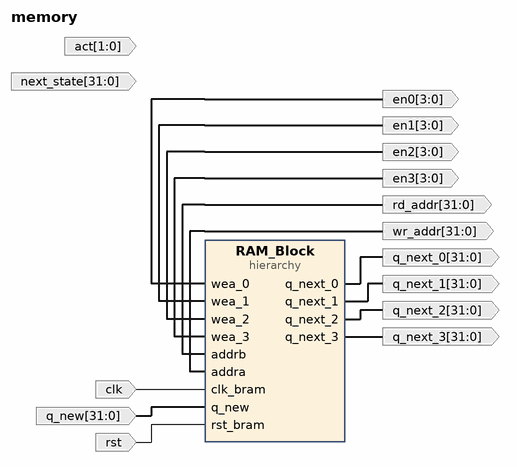
[diagram p0: block diagram of the top level]
# Vivado block design memory, xc7z020clg400-1, Vivado 2021.1
create_bd_design memory

create_bd_port -dir I -type clk clk
set_property -dict {CONFIG.FREQ_HZ 50000000} [get_bd_ports clk]
create_bd_port -dir I -type rst rst
create_bd_port -dir I -from 31 -to 0 q_new
create_bd_port -dir O -from 31 -to 0 q_next_3
create_bd_port -dir O -from 31 -to 0 q_next_0
create_bd_port -dir O -from 31 -to 0 q_next_1
create_bd_port -dir O -from 31 -to 0 q_next_2
create_bd_port -dir O -from 31 -to 0 rd_addr
create_bd_port -dir O -from 31 -to 0 wr_addr
create_bd_port -dir O -from 3 -to 0 en0
create_bd_port -dir O -from 3 -to 0 en1
create_bd_port -dir O -from 3 -to 0 en2
create_bd_port -dir O -from 3 -to 0 en3
create_bd_port -dir I -from 1 -to 0 act
create_bd_port -dir I -from 31 -to 0 next_state

create_bd_cell -type hier RAM_Block

# ---- hierarchy /RAM_Block ----
current_bd_instance /RAM_Block
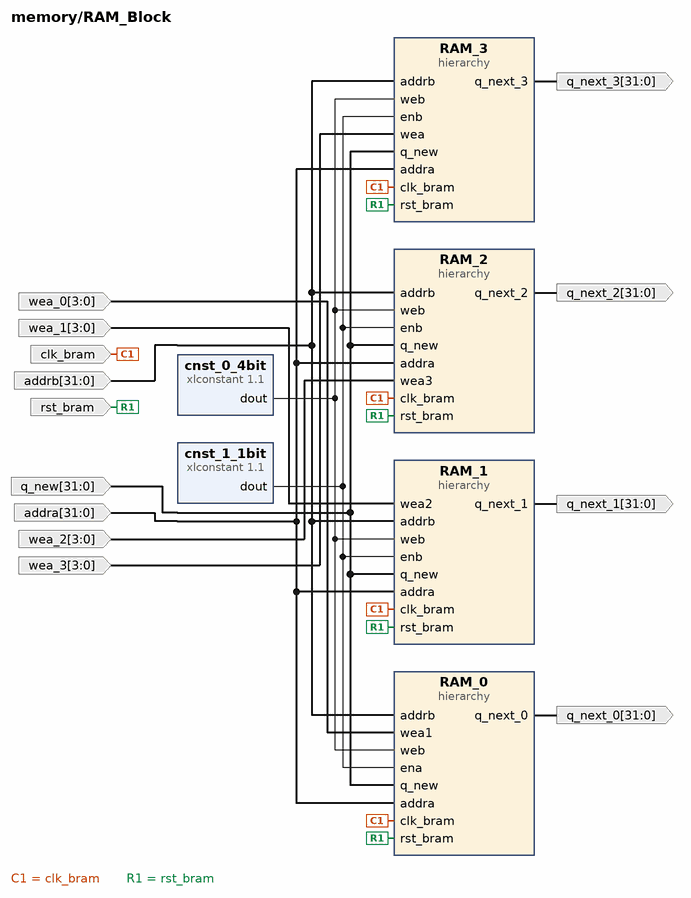
[diagram p1: block diagram inside /RAM_Block]
create_bd_pin -dir I -type clk clk_bram
create_bd_pin -dir I -type rst rst_bram
create_bd_pin -dir I -from 3 -to 0 wea_3
create_bd_pin -dir I -from 31 -to 0 addra
create_bd_pin -dir I -from 31 -to 0 q_new
create_bd_pin -dir I -from 31 -to 0 addrb
create_bd_pin -dir O -from 31 -to 0 q_next_3
create_bd_pin -dir I -from 3 -to 0 wea_0
create_bd_pin -dir O -from 31 -to 0 q_next_0
create_bd_pin -dir I -from 3 -to 0 wea_1
create_bd_pin -dir O -from 31 -to 0 q_next_1
create_bd_pin -dir I -from 3 -to 0 wea_2
create_bd_pin -dir O -from 31 -to 0 q_next_2

create_bd_cell -type ip -vlnv xilinx.com:ip:xlconstant:1.1 cnst_0_4bit
set_property -dict {CONFIG.CONST_VAL 0 CONFIG.CONST_WIDTH 4} [get_bd_cells cnst_0_4bit]
create_bd_cell -type ip -vlnv xilinx.com:ip:xlconstant:1.1 cnst_1_1bit
create_bd_cell -type hier RAM_2
create_bd_cell -type hier RAM_1
create_bd_cell -type hier RAM_3
create_bd_cell -type hier RAM_0

# ---- hierarchy /RAM_Block/RAM_2 ----
current_bd_instance /RAM_Block/RAM_2
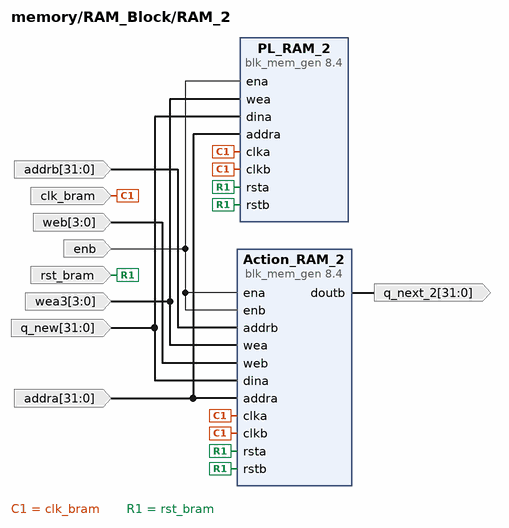
[diagram p2: block diagram inside /RAM_Block/RAM_2]
create_bd_pin -dir I -type clk clk_bram
create_bd_pin -dir I -type rst rst_bram
create_bd_pin -dir I enb
create_bd_pin -dir I -from 3 -to 0 wea3
create_bd_pin -dir I -from 31 -to 0 addra
create_bd_pin -dir I -from 31 -to 0 q_new
create_bd_pin -dir I -from 3 -to 0 web
create_bd_pin -dir I -from 31 -to 0 addrb
create_bd_pin -dir O -from 31 -to 0 q_next_2

create_bd_cell -type ip -vlnv xilinx.com:ip:blk_mem_gen:8.4 Action_RAM_2
set_property -dict [list \
  CONFIG.EN_SAFETY_CKT true \
  CONFIG.Enable_32bit_Address true \
  CONFIG.Enable_B Use_ENB_Pin \
  CONFIG.Memory_Type True_Dual_Port_RAM \
  CONFIG.Port_B_Clock 100 \
  CONFIG.Port_B_Enable_Rate 100 \
  CONFIG.Port_B_Write_Rate 50 \
  CONFIG.Read_Width_A 32 \
  CONFIG.Read_Width_B 32 \
  CONFIG.Register_PortA_Output_of_Memory_Primitives false \
  CONFIG.Register_PortB_Output_of_Memory_Primitives false \
  CONFIG.Use_RSTA_Pin true \
  CONFIG.Use_RSTB_Pin true \
  CONFIG.Write_Width_A 32 \
  CONFIG.Write_Width_B 32 \
  CONFIG.use_bram_block BRAM_Controller \
] [get_bd_cells Action_RAM_2]
create_bd_cell -type ip -vlnv xilinx.com:ip:blk_mem_gen:8.4 PL_RAM_2
set_property -dict [list \
  CONFIG.Enable_B Use_ENB_Pin \
  CONFIG.Memory_Type True_Dual_Port_RAM \
  CONFIG.Port_B_Clock 100 \
  CONFIG.Port_B_Enable_Rate 100 \
  CONFIG.Port_B_Write_Rate 50 \
  CONFIG.Use_RSTB_Pin true \
] [get_bd_cells PL_RAM_2]

# ---- hierarchy /RAM_Block/RAM_1 ----
current_bd_instance /RAM_Block/RAM_1
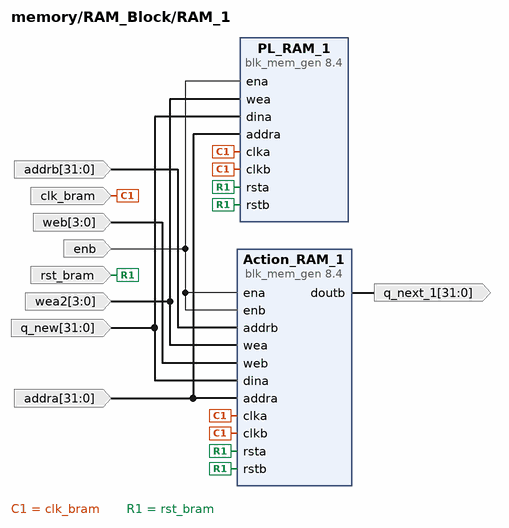
[diagram p3: block diagram inside /RAM_Block/RAM_1]
create_bd_pin -dir I -type clk clk_bram
create_bd_pin -dir I -type rst rst_bram
create_bd_pin -dir I enb
create_bd_pin -dir I -from 3 -to 0 wea2
create_bd_pin -dir I -from 31 -to 0 addra
create_bd_pin -dir I -from 31 -to 0 q_new
create_bd_pin -dir I -from 3 -to 0 web
create_bd_pin -dir I -from 31 -to 0 addrb
create_bd_pin -dir O -from 31 -to 0 q_next_1

create_bd_cell -type ip -vlnv xilinx.com:ip:blk_mem_gen:8.4 Action_RAM_1
set_property -dict [list \
  CONFIG.EN_SAFETY_CKT true \
  CONFIG.Enable_32bit_Address true \
  CONFIG.Enable_B Use_ENB_Pin \
  CONFIG.Memory_Type True_Dual_Port_RAM \
  CONFIG.Port_B_Clock 100 \
  CONFIG.Port_B_Enable_Rate 100 \
  CONFIG.Port_B_Write_Rate 50 \
  CONFIG.Read_Width_A 32 \
  CONFIG.Read_Width_B 32 \
  CONFIG.Register_PortA_Output_of_Memory_Primitives false \
  CONFIG.Register_PortB_Output_of_Memory_Primitives false \
  CONFIG.Use_RSTA_Pin true \
  CONFIG.Use_RSTB_Pin true \
  CONFIG.Write_Width_A 32 \
  CONFIG.Write_Width_B 32 \
  CONFIG.use_bram_block BRAM_Controller \
] [get_bd_cells Action_RAM_1]
create_bd_cell -type ip -vlnv xilinx.com:ip:blk_mem_gen:8.4 PL_RAM_1
set_property -dict [list \
  CONFIG.Enable_B Use_ENB_Pin \
  CONFIG.Memory_Type True_Dual_Port_RAM \
  CONFIG.Port_B_Clock 100 \
  CONFIG.Port_B_Enable_Rate 100 \
  CONFIG.Port_B_Write_Rate 50 \
  CONFIG.Use_RSTB_Pin true \
] [get_bd_cells PL_RAM_1]

# ---- hierarchy /RAM_Block/RAM_3 ----
current_bd_instance /RAM_Block/RAM_3
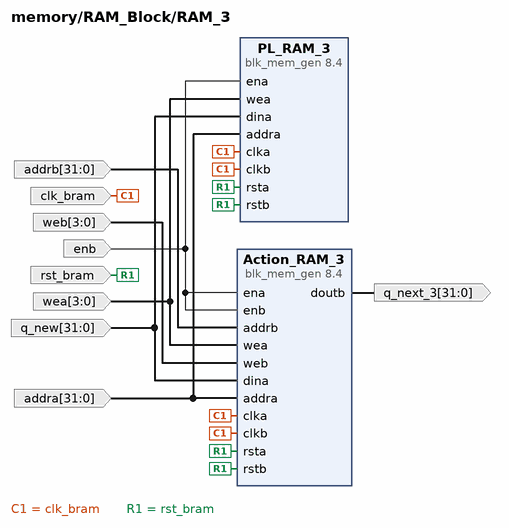
[diagram p4: block diagram inside /RAM_Block/RAM_3]
create_bd_pin -dir I -type clk clk_bram
create_bd_pin -dir I -type rst rst_bram
create_bd_pin -dir I enb
create_bd_pin -dir I -from 3 -to 0 wea
create_bd_pin -dir I -from 31 -to 0 addra
create_bd_pin -dir I -from 31 -to 0 q_new
create_bd_pin -dir I -from 3 -to 0 web
create_bd_pin -dir I -from 31 -to 0 addrb
create_bd_pin -dir O -from 31 -to 0 q_next_3

create_bd_cell -type ip -vlnv xilinx.com:ip:blk_mem_gen:8.4 Action_RAM_3
set_property -dict [list \
  CONFIG.EN_SAFETY_CKT true \
  CONFIG.Enable_32bit_Address true \
  CONFIG.Enable_B Use_ENB_Pin \
  CONFIG.Memory_Type True_Dual_Port_RAM \
  CONFIG.Port_B_Clock 100 \
  CONFIG.Port_B_Enable_Rate 100 \
  CONFIG.Port_B_Write_Rate 50 \
  CONFIG.Read_Width_A 32 \
  CONFIG.Read_Width_B 32 \
  CONFIG.Register_PortA_Output_of_Memory_Primitives false \
  CONFIG.Register_PortB_Output_of_Memory_Primitives false \
  CONFIG.Use_RSTA_Pin true \
  CONFIG.Use_RSTB_Pin true \
  CONFIG.Write_Width_A 32 \
  CONFIG.Write_Width_B 32 \
  CONFIG.use_bram_block BRAM_Controller \
] [get_bd_cells Action_RAM_3]
create_bd_cell -type ip -vlnv xilinx.com:ip:blk_mem_gen:8.4 PL_RAM_3
set_property -dict [list \
  CONFIG.Enable_B Use_ENB_Pin \
  CONFIG.Memory_Type True_Dual_Port_RAM \
  CONFIG.Port_B_Clock 100 \
  CONFIG.Port_B_Enable_Rate 100 \
  CONFIG.Port_B_Write_Rate 50 \
  CONFIG.Use_RSTB_Pin true \
] [get_bd_cells PL_RAM_3]

# ---- hierarchy /RAM_Block/RAM_0 ----
current_bd_instance /RAM_Block/RAM_0
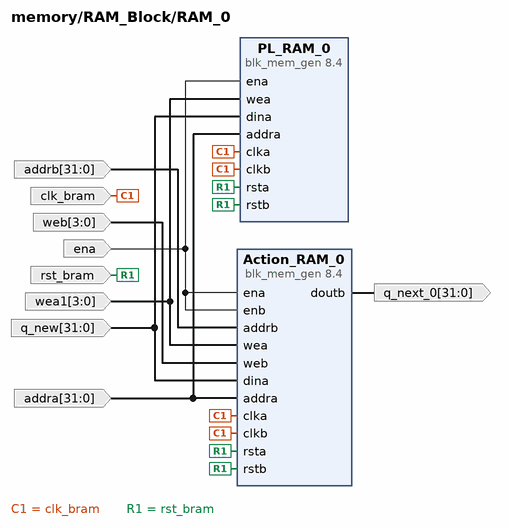
[diagram p5: block diagram inside /RAM_Block/RAM_0]
create_bd_pin -dir I -type clk clk_bram
create_bd_pin -dir I -type rst rst_bram
create_bd_pin -dir I ena
create_bd_pin -dir I -from 3 -to 0 wea1
create_bd_pin -dir I -from 31 -to 0 addra
create_bd_pin -dir I -from 31 -to 0 q_new
create_bd_pin -dir I -from 3 -to 0 web
create_bd_pin -dir I -from 31 -to 0 addrb
create_bd_pin -dir O -from 31 -to 0 q_next_0

create_bd_cell -type ip -vlnv xilinx.com:ip:blk_mem_gen:8.4 PL_RAM_0
set_property -dict [list \
  CONFIG.Enable_B Use_ENB_Pin \
  CONFIG.Memory_Type True_Dual_Port_RAM \
  CONFIG.Port_B_Clock 100 \
  CONFIG.Port_B_Enable_Rate 100 \
  CONFIG.Port_B_Write_Rate 50 \
  CONFIG.Use_RSTB_Pin true \
] [get_bd_cells PL_RAM_0]
create_bd_cell -type ip -vlnv xilinx.com:ip:blk_mem_gen:8.4 Action_RAM_0
set_property -dict [list \
  CONFIG.EN_SAFETY_CKT true \
  CONFIG.Enable_32bit_Address true \
  CONFIG.Enable_B Use_ENB_Pin \
  CONFIG.Memory_Type True_Dual_Port_RAM \
  CONFIG.Port_B_Clock 100 \
  CONFIG.Port_B_Enable_Rate 100 \
  CONFIG.Port_B_Write_Rate 50 \
  CONFIG.Read_Width_A 32 \
  CONFIG.Read_Width_B 32 \
  CONFIG.Register_PortA_Output_of_Memory_Primitives false \
  CONFIG.Register_PortB_Output_of_Memory_Primitives false \
  CONFIG.Use_RSTA_Pin true \
  CONFIG.Use_RSTB_Pin true \
  CONFIG.Write_Width_A 32 \
  CONFIG.Write_Width_B 32 \
  CONFIG.use_bram_block BRAM_Controller \
] [get_bd_cells Action_RAM_0]

# ---- connections ----

current_bd_instance /RAM_Block
connect_bd_net -net Action_RAM_0_doutb [get_bd_pins RAM_0/q_next_0] [get_bd_pins q_next_0]
connect_bd_net -net Action_RAM_1_doutb [get_bd_pins RAM_1/q_next_1] [get_bd_pins q_next_1]
connect_bd_net -net Action_RAM_2_doutb [get_bd_pins RAM_2/q_next_2] [get_bd_pins q_next_2]
connect_bd_net -net Action_RAM_3_doutb [get_bd_pins RAM_3/q_next_3] [get_bd_pins q_next_3]
connect_bd_net -net bram_interface_0_en0 [get_bd_pins wea_0] [get_bd_pins RAM_0/wea1]
connect_bd_net -net bram_interface_0_en1 [get_bd_pins wea_1] [get_bd_pins RAM_1/wea2]
connect_bd_net -net bram_interface_0_en2 [get_bd_pins wea_2] [get_bd_pins RAM_2/wea3]
connect_bd_net -net bram_interface_0_en3 [get_bd_pins wea_3] [get_bd_pins RAM_3/wea]
connect_bd_net -net bram_interface_0_rd_addr [get_bd_pins addrb] \
  [get_bd_pins RAM_2/addrb] [get_bd_pins RAM_1/addrb] [get_bd_pins RAM_3/addrb] [get_bd_pins RAM_0/addrb]
connect_bd_net -net clk_0_1 [get_bd_pins clk_bram] \
  [get_bd_pins RAM_2/clk_bram] [get_bd_pins RAM_1/clk_bram] [get_bd_pins RAM_3/clk_bram] [get_bd_pins RAM_0/clk_bram]
connect_bd_net [get_bd_pins cnst_0_4bit/dout] [get_bd_pins RAM_2/web] [get_bd_pins RAM_1/web] [get_bd_pins RAM_3/web] [get_bd_pins RAM_0/web]
connect_bd_net [get_bd_pins cnst_1_1bit/dout] [get_bd_pins RAM_2/enb] [get_bd_pins RAM_1/enb] [get_bd_pins RAM_3/enb] [get_bd_pins RAM_0/ena]
connect_bd_net -net dina_0_1 [get_bd_pins q_new] \
  [get_bd_pins RAM_2/q_new] [get_bd_pins RAM_1/q_new] [get_bd_pins RAM_3/q_new] [get_bd_pins RAM_0/q_new]
connect_bd_net -net reg_32bit_0_out0 [get_bd_pins addra] \
  [get_bd_pins RAM_2/addra] [get_bd_pins RAM_1/addra] [get_bd_pins RAM_3/addra] [get_bd_pins RAM_0/addra]
connect_bd_net -net rsta_0_1 [get_bd_pins rst_bram] \
  [get_bd_pins RAM_2/rst_bram] [get_bd_pins RAM_1/rst_bram] [get_bd_pins RAM_3/rst_bram] [get_bd_pins RAM_0/rst_bram]

current_bd_instance /RAM_Block/RAM_2
connect_bd_net [get_bd_pins Action_RAM_2/doutb] [get_bd_pins q_next_2]
connect_bd_net -net bram_interface_0_en2 [get_bd_pins wea3] [get_bd_pins PL_RAM_2/wea] [get_bd_pins Action_RAM_2/wea]
connect_bd_net -net bram_interface_0_rd_addr [get_bd_pins addrb] [get_bd_pins Action_RAM_2/addrb]
connect_bd_net -net clk_0_1 [get_bd_pins clk_bram] \
  [get_bd_pins Action_RAM_2/clkb] [get_bd_pins PL_RAM_2/clka] [get_bd_pins Action_RAM_2/clka] [get_bd_pins PL_RAM_2/clkb]
connect_bd_net -net cnst_0_4bit_dout [get_bd_pins web] [get_bd_pins Action_RAM_2/web]
connect_bd_net -net cnst_1_1bit_dout [get_bd_pins enb] [get_bd_pins Action_RAM_2/enb] [get_bd_pins PL_RAM_2/ena] [get_bd_pins Action_RAM_2/ena]
connect_bd_net -net dina_0_1 [get_bd_pins q_new] [get_bd_pins PL_RAM_2/dina] [get_bd_pins Action_RAM_2/dina]
connect_bd_net -net reg_32bit_0_out0 [get_bd_pins addra] [get_bd_pins PL_RAM_2/addra] [get_bd_pins Action_RAM_2/addra]
connect_bd_net -net rsta_0_1 [get_bd_pins rst_bram] \
  [get_bd_pins Action_RAM_2/rstb] [get_bd_pins PL_RAM_2/rsta] [get_bd_pins Action_RAM_2/rsta] [get_bd_pins PL_RAM_2/rstb]

current_bd_instance /RAM_Block/RAM_1
connect_bd_net [get_bd_pins Action_RAM_1/doutb] [get_bd_pins q_next_1]
connect_bd_net -net bram_interface_0_en1 [get_bd_pins wea2] [get_bd_pins PL_RAM_1/wea] [get_bd_pins Action_RAM_1/wea]
connect_bd_net -net bram_interface_0_rd_addr [get_bd_pins addrb] [get_bd_pins Action_RAM_1/addrb]
connect_bd_net -net clk_0_1 [get_bd_pins clk_bram] \
  [get_bd_pins Action_RAM_1/clkb] [get_bd_pins PL_RAM_1/clka] [get_bd_pins Action_RAM_1/clka] [get_bd_pins PL_RAM_1/clkb]
connect_bd_net -net cnst_0_4bit_dout [get_bd_pins web] [get_bd_pins Action_RAM_1/web]
connect_bd_net -net cnst_1_1bit_dout [get_bd_pins enb] [get_bd_pins Action_RAM_1/enb] [get_bd_pins PL_RAM_1/ena] [get_bd_pins Action_RAM_1/ena]
connect_bd_net -net dina_0_1 [get_bd_pins q_new] [get_bd_pins PL_RAM_1/dina] [get_bd_pins Action_RAM_1/dina]
connect_bd_net -net reg_32bit_0_out0 [get_bd_pins addra] [get_bd_pins PL_RAM_1/addra] [get_bd_pins Action_RAM_1/addra]
connect_bd_net -net rsta_0_1 [get_bd_pins rst_bram] \
  [get_bd_pins Action_RAM_1/rstb] [get_bd_pins PL_RAM_1/rsta] [get_bd_pins Action_RAM_1/rsta] [get_bd_pins PL_RAM_1/rstb]

current_bd_instance /RAM_Block/RAM_3
connect_bd_net [get_bd_pins Action_RAM_3/doutb] [get_bd_pins q_next_3]
connect_bd_net -net bram_interface_0_en3 [get_bd_pins wea] [get_bd_pins PL_RAM_3/wea] [get_bd_pins Action_RAM_3/wea]
connect_bd_net -net bram_interface_0_rd_addr [get_bd_pins addrb] [get_bd_pins Action_RAM_3/addrb]
connect_bd_net -net clk_0_1 [get_bd_pins clk_bram] \
  [get_bd_pins Action_RAM_3/clkb] [get_bd_pins PL_RAM_3/clka] [get_bd_pins Action_RAM_3/clka] [get_bd_pins PL_RAM_3/clkb]
connect_bd_net -net cnst_0_4bit_dout [get_bd_pins web] [get_bd_pins Action_RAM_3/web]
connect_bd_net -net cnst_1_1bit_dout [get_bd_pins enb] [get_bd_pins Action_RAM_3/enb] [get_bd_pins PL_RAM_3/ena] [get_bd_pins Action_RAM_3/ena]
connect_bd_net -net dina_0_1 [get_bd_pins q_new] [get_bd_pins PL_RAM_3/dina] [get_bd_pins Action_RAM_3/dina]
connect_bd_net -net reg_32bit_0_out0 [get_bd_pins addra] [get_bd_pins PL_RAM_3/addra] [get_bd_pins Action_RAM_3/addra]
connect_bd_net -net rsta_0_1 [get_bd_pins rst_bram] \
  [get_bd_pins Action_RAM_3/rstb] [get_bd_pins PL_RAM_3/rsta] [get_bd_pins Action_RAM_3/rsta] [get_bd_pins PL_RAM_3/rstb]

current_bd_instance /RAM_Block/RAM_0
connect_bd_net [get_bd_pins Action_RAM_0/doutb] [get_bd_pins q_next_0]
connect_bd_net -net bram_interface_0_en0 [get_bd_pins wea1] [get_bd_pins Action_RAM_0/wea] [get_bd_pins PL_RAM_0/wea]
connect_bd_net -net bram_interface_0_rd_addr [get_bd_pins addrb] [get_bd_pins Action_RAM_0/addrb]
connect_bd_net -net clk_0_1 [get_bd_pins clk_bram] \
  [get_bd_pins Action_RAM_0/clkb] [get_bd_pins Action_RAM_0/clka] [get_bd_pins PL_RAM_0/clka] [get_bd_pins PL_RAM_0/clkb]
connect_bd_net -net cnst_0_4bit_dout [get_bd_pins web] [get_bd_pins Action_RAM_0/web]
connect_bd_net -net cnst_1_1bit_dout [get_bd_pins ena] [get_bd_pins Action_RAM_0/ena] [get_bd_pins Action_RAM_0/enb] [get_bd_pins PL_RAM_0/ena]
connect_bd_net -net dina_0_1 [get_bd_pins q_new] [get_bd_pins Action_RAM_0/dina] [get_bd_pins PL_RAM_0/dina]
connect_bd_net -net reg_32bit_0_out0 [get_bd_pins addra] [get_bd_pins Action_RAM_0/addra] [get_bd_pins PL_RAM_0/addra]
connect_bd_net -net rsta_0_1 [get_bd_pins rst_bram] \
  [get_bd_pins Action_RAM_0/rstb] [get_bd_pins Action_RAM_0/rsta] [get_bd_pins PL_RAM_0/rsta] [get_bd_pins PL_RAM_0/rstb]

current_bd_instance /
connect_bd_net [get_bd_pins RAM_Block/q_next_0] [get_bd_ports q_next_0]
connect_bd_net [get_bd_pins RAM_Block/q_next_1] [get_bd_ports q_next_1]
connect_bd_net [get_bd_pins RAM_Block/q_next_2] [get_bd_ports q_next_2]
connect_bd_net [get_bd_pins RAM_Block/q_next_3] [get_bd_ports q_next_3]
connect_bd_net -net bram_interface_0_en0 [get_bd_pins RAM_Block/wea_0] [get_bd_ports en0]
connect_bd_net -net bram_interface_0_en1 [get_bd_pins RAM_Block/wea_1] [get_bd_ports en1]
connect_bd_net -net bram_interface_0_en2 [get_bd_pins RAM_Block/wea_2] [get_bd_ports en2]
connect_bd_net -net bram_interface_0_en3 [get_bd_pins RAM_Block/wea_3] [get_bd_ports en3]
connect_bd_net -net bram_interface_0_rd_addr [get_bd_pins RAM_Block/addrb] [get_bd_ports rd_addr]
connect_bd_net -net bram_interface_0_wr_addr [get_bd_pins RAM_Block/addra] [get_bd_ports wr_addr]
connect_bd_net -net clk_0_1 [get_bd_ports clk] [get_bd_pins RAM_Block/clk_bram]
connect_bd_net -net q_new_0_1 [get_bd_ports q_new] [get_bd_pins RAM_Block/q_new]
connect_bd_net -net rst_0_1 [get_bd_ports rst] [get_bd_pins RAM_Block/rst_bram]

validate_bd_design
save_bd_design
